# EAGLE design MiniGuruV2 (EAGLE 5.07)
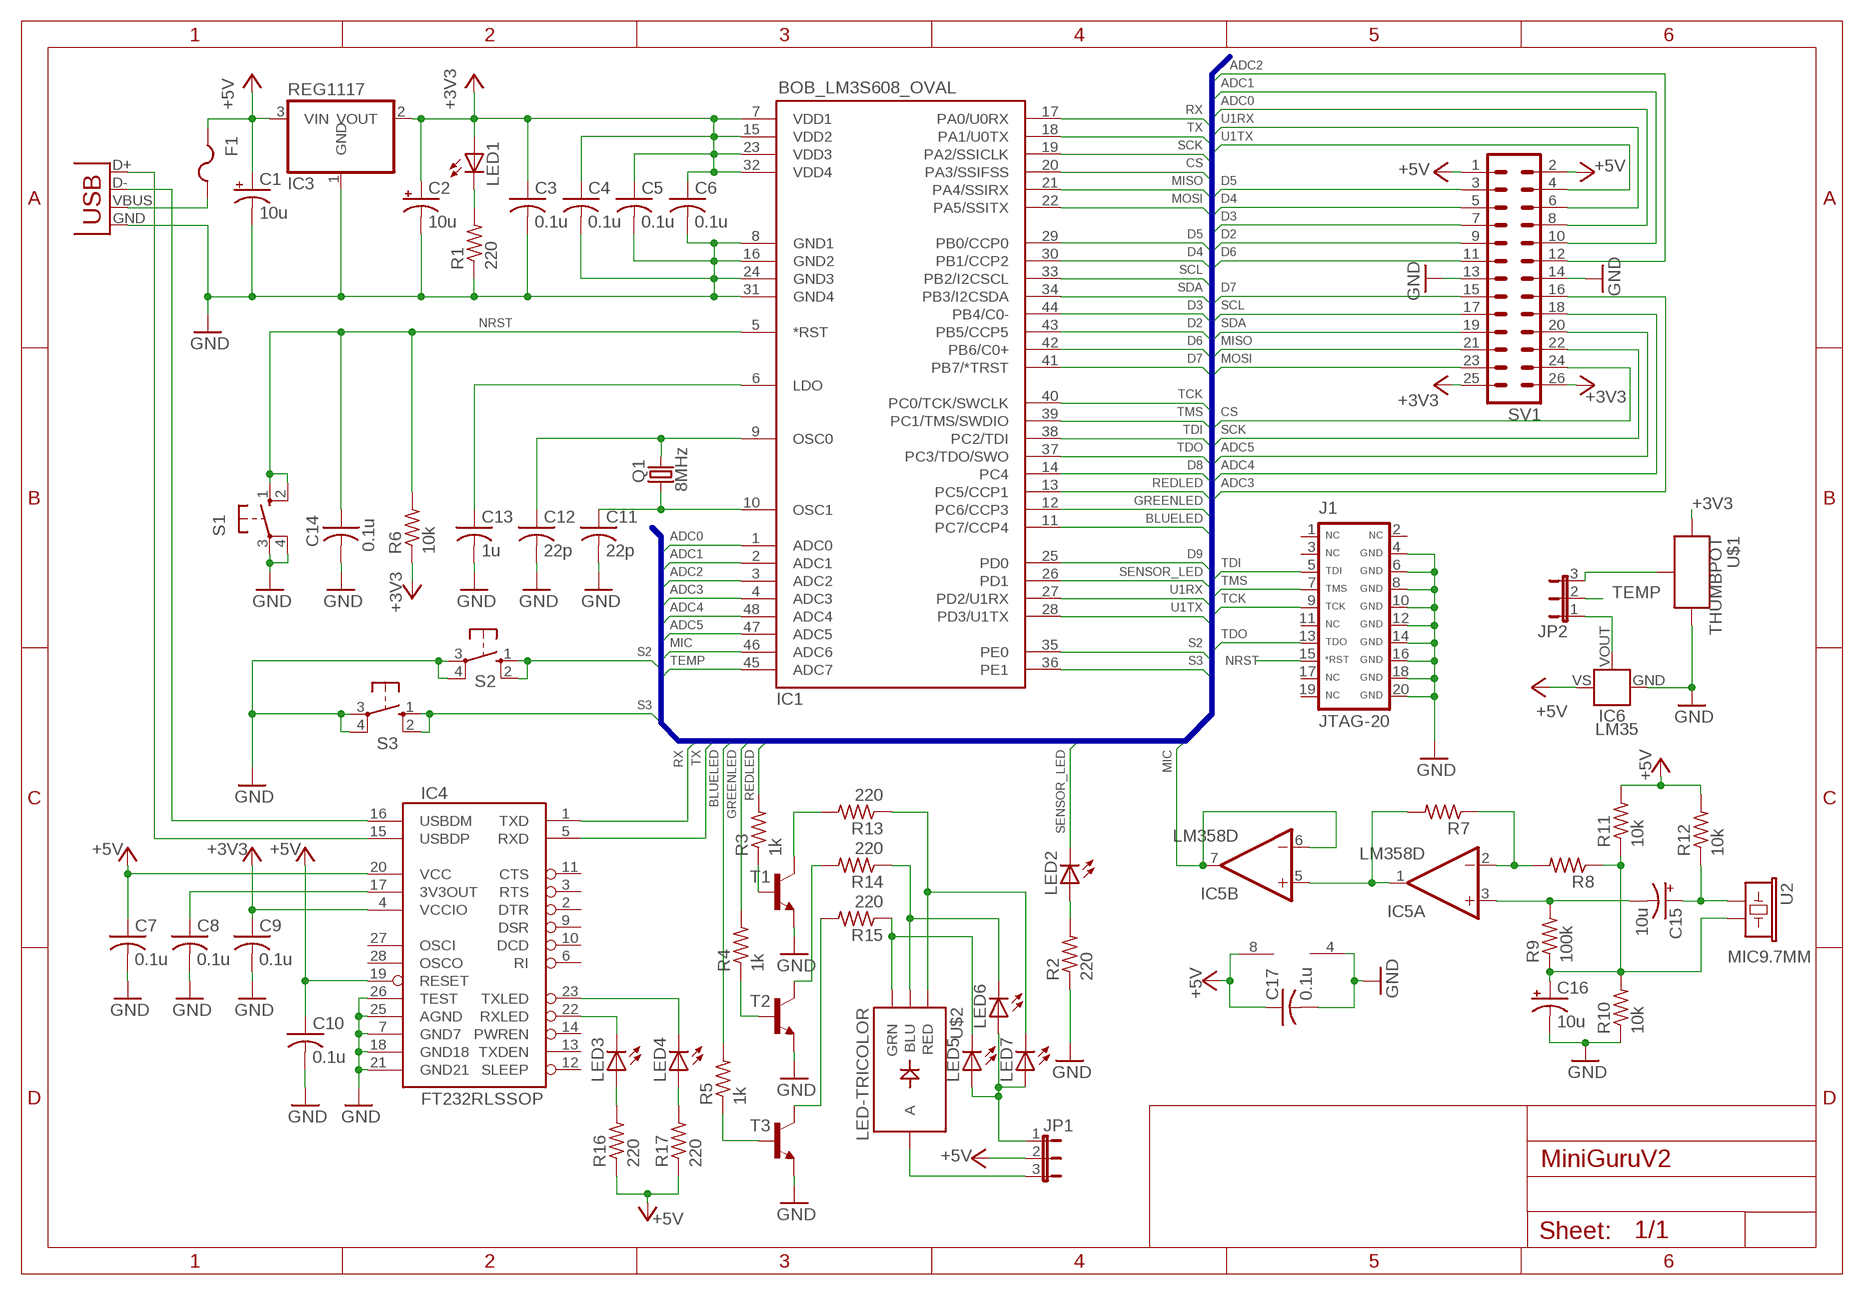
[diagram p0: schematic, sheet 1]

## Parts
C1  10u  CAP_POL_16V  [B/3528-21R]
C2  10u  CAP_POL_16V  [B/3528-21R]
C3  0.1u  C-USC0805  [C0805]
C4  0.1u  C-USC0805  [C0805]
C5  0.1u  C-USC0805  [C0805]
C6  0.1u  C-USC0805  [C0805]
C7  0.1u  C-USC0805  [C0805]
C8  0.1u  C-USC0805  [C0805]
C9  0.1u  C-USC0805  [C0805]
C10  0.1u  C-USC0805  [C0805]
C11  22p  C-USC0805  [C0805]
C12  22p  C-USC0805  [C0805]
C13  1u  C-USC1206  [C1206]
C14  0.1u  C-USC0805  [C0805]
C15  10u  CAP_POL_16V  [B/3528-21R]
C16  10u  CAP_POL_16V  [B/3528-21R]
C17  0.1u  C-USC0805  [C0805]
F1  PTCFUSE-1206  [R1206]
IC1  BOB_LM3S608_OVAL  [BOB_LQFP48_OVAL]
IC3  REG1117  [SOT223]
IC4  FT232RLSSOP  [SSOP28DB]
IC5  LM358D  [SO08]
IC6  LM35  LM35TO-92  [TO92]
J1  JTAG-20  [JTAG-20]
JP1  JP2W  [JP2W]
JP2  JP2W  [JP2W]
LED1  LEDSMT1206  [1206]
LED2  LEDSMT1206  [1206]
LED3  LEDSMT1206  [1206]
LED4  LEDSMT1206  [1206]
LED5  LEDSMT1206  [1206]
LED6  LEDSMT1206  [1206]
LED7  LEDSMT1206  [1206]
Q1  8MHz  CRYSTALHC49US  [HC49US]
R1  220  R-US_R0805  [R0805]
R2  220  R-US_R0805  [R0805]
R3  1k  R-US_R0805  [R0805]
R4  1k  R-US_R0805  [R0805]
R5  1k  R-US_R0805  [R0805]
R6  10k  R-US_R0805  [R0805]
R7  R-US_R0805  [R0805]
R8  R-US_R0805  [R0805]
R9  100k  R-US_R0805  [R0805]
R10  10k  R-US_R0805  [R0805]
R11  10k  R-US_R0805  [R0805]
R12  10k  R-US_R0805  [R0805]
R13  220  R-US_R0805  [R0805]
R14  220  R-US_R0805  [R0805]
R15  220  R-US_R0805  [R0805]
R16  220  R-US_R0805  [R0805]
R17  220  R-US_R0805  [R0805]
S1  10-XX  [B3F-10XX]
S2  10-XX  [B3F-10XX]
S3  10-XX  [B3F-10XX]
SV1  MA13-2  [MA13-2]
T1  BC847  [SOT23]
T2  BC847  [SOT23]
T3  BC847  [SOT23]
U2  MIC9.7MM  [MIC-9.7MM]
U$1  THUMBPOT  [THUMBPOT]
U$2  LED-TRICOLOR  [LED-TRICOLOR-SMD]
X1  USBSMD  [USB-MINIB]

## Nets
+3V3 [+3V3]: C2.+ C3.1 C4.1 C5.1 C6.1 C9.1 IC1.7(VDD1) IC1.15(VDD2) IC1.23(VDD3) IC1.32(VDD4) IC3.2(VOUT) IC4.4(VCCIO) LED1.A R6.1 SV1.25 SV1.26 U$1.1(E)
+5V [power]: C1.+ C7.1 C10.1 C17.1 F1.1 IC3.3(VIN) IC4.19(RESET) IC4.20(VCC) IC5.8(P:V+) IC6.VS JP1.2 R11.2 R12.2 R16.1 R17.1 SV1.1 SV1.2
ADC0: IC1.1(ADC0) SV1.8
ADC1: IC1.2(ADC1) SV1.10
ADC2: IC1.3(ADC2) SV1.12
ADC3: IC1.4(ADC3) SV1.16
ADC4: IC1.48(ADC4) SV1.18
ADC5: IC1.47(ADC5) SV1.20
BLUELED: IC1.11(PC7/CCP4) R5.2
CS: IC1.20(PA3/SSIFSS) SV1.24
D2: IC1.43(PB5/CCP5) SV1.9
D3: IC1.44(PB4/C0-) SV1.7
D4: IC1.30(PB1/CCP2) SV1.5
D5: IC1.29(PB0/CCP0) SV1.3
D6: IC1.42(PB6/C0+) SV1.11
D7: IC1.41(PB7/*TRST) SV1.15
D8: IC1.14(PC4)
D9: IC1.25(PD0)
GND [GND]: C1.- C2.- C3.2 C4.2 C5.2 C6.2 C7.2 C8.2 C9.2 C10.2 C11.2 C12.2 C13.2 C14.2 C16.- C17.2 IC1.8(GND1) IC1.16(GND2) IC1.24(GND3) IC1.31(GND4) IC3.1(GND) IC4.7(GND7) IC4.18(GND18) IC4.21(GND21) IC4.25(AGND) IC4.26(TEST) IC5.4(P:V-) IC6.GND J1.4(GND) J1.6(GND) J1.8(GND) J1.10(GND) J1.12(GND) J1.14(GND) J1.16(GND) J1.18(GND) J1.20(GND) R1.1 R2.1 R10.1 S1.3(P) S1.4(P1) S2.3(P) S2.4(P1) S3.3(P) S3.4(P1) SV1.13 SV1.14 T1.2(E) T2.2(E) T3.2(E) U$1.3(A) X1.GND
GREENLED: IC1.12(PC6/CCP3) R4.2
MIC: IC1.46(ADC6) IC5.6(B:-IN) IC5.7(B:OUT)
MISO: IC1.21(PA4/SSIRX) SV1.21
MOSI: IC1.22(PA5/SSITX) SV1.23
N$1: IC4.22(RXLED) LED3.C
N$2: IC4.16(USBDM) X1.D-
N$3: LED1.C R1.2
N$4: IC4.15(USBDP) X1.D+
N$5: C8.1 IC4.17(3V3OUT)
N$6: IC4.23(TXLED) LED4.C
N$7: LED4.A R17.2
N$8: LED3.A R16.2
N$9: IC6.VOUT JP2.1
N$10: R3.1 T1.1(B)
N$11: C12.1 IC1.9(OSC0) Q1.2
N$12: C11.1 IC1.10(OSC1) Q1.1
N$13: C13.1 IC1.6(LDO)
N$14: R4.1 T2.1(B)
N$15: R5.1 T3.1(B)
N$16: LED2.A R2.2
N$17: R13.2 T1.3(C)
N$18: IC5.1(A:OUT) IC5.5(B:+IN) R7.2
N$19: IC5.2(A:-IN) R7.1 R8.2
N$20: C15.+ R12.1 U2.1
N$21: C16.+ R8.1 R9.1 R10.2 R11.1 U2.2
N$22: C15.- IC5.3(A:+IN) R9.2
N$23: LED7.C R13.1 U$2.R(RED)
N$24: R14.2 T2.3(C)
N$25: LED6.C R14.1 U$2.B(BLU)
N$26: R15.2 T3.3(C)
N$27: LED5.C R15.1 U$2.G(GRN)
N$28 [power]: F1.2 X1.VBUS
N$29: JP2.3 U$1.2(S)
N$34: JP1.3 U$2.A
N$35 [power]: JP1.1 LED5.A LED6.A LED7.A
NRST: C14.1 IC1.5(*RST) J1.15(RST) R6.2 S1.1(S) S1.2(S1)
REDLED: IC1.13(PC5/CCP1) R3.2
RX: IC1.17(PA0/U0RX) IC4.1(TXD)
S2: IC1.35(PE0) S2.1(S) S2.2(S1)
S3: IC1.36(PE1) S3.1(S) S3.2(S1)
SCK: IC1.19(PA2/SSICLK) SV1.22
SCL: IC1.33(PB2/I2CSCL) SV1.17
SDA: IC1.34(PB3/I2CSDA) SV1.19
SENSOR_LED: IC1.26(PD1) LED2.C
TCK: IC1.40(PC0/TCK/SWCLK) J1.9(TCK)
TDI: IC1.38(PC2/TDI) J1.5(TDI)
TDO: IC1.37(PC3/TDO/SWO) J1.13(TDO)
TEMP: IC1.45(ADC7) JP2.2
TMS: IC1.39(PC1/TMS/SWDIO) J1.7(TMS)
TX: IC1.18(PA1/U0TX) IC4.5(RXD)
U1RX: IC1.27(PD2/U1RX) SV1.6
U1TX: IC1.28(PD3/U1TX) SV1.4
Unconnected: IC4.2(DTR) IC4.3(RTS) IC4.6(RI) IC4.9(DSR) IC4.10(DCD) IC4.11(CTS) IC4.12(SLEEP) IC4.13(TXDEN) IC4.14(PWREN) IC4.27(OSCI) IC4.28(OSCO) J1.1(VREF) J1.2(VTAR) J1.3(NTRST) J1.11(RTCK) J1.17(OBGRQ) J1.19(OBGACK)

## Buses
ADC0,ADC1,ADC2,ADC3,ADC4,ADC5,MISO,MOSI,CS,SCK,RX,TX,D2,D3,D4,D5,D6,D7,D8,D9,U1RX,U1TX,TCK,TMS,TDI,TDO,SENSOR_LED,REDLED,GREENLED,BLUELED,S2,S3,MIC,TEMP,SDA,SCL

## Library data of the parts
C1 C2 C15 C16 = CEDTv50:CAP_POL
C3-C14 C17 = adafruit:C-US: CAPACITOR, American symbol
F1 = adafruit:PTCFUSE: PTC fuses, resettable thermistors
IC1 = CEDTv51:BOB_LM3S608_OVAL
IC3 = CEDTv50:REG1117: 800mA and 1A Low Dropout (LDO) Positive Regulator 1.8V, 2.5V, 2.85V, 3.3V, 5V, and Adj
IC4 = SparkFun:FT232RL: USB UART FT232RL 4th Generation USB UART (USB <-> Serial) Controller. Spark Fun Electronics SKU : COM-00650
IC5 = linear:LM358: OP AMP also LM158; LM258; LM2904 Source: http://cache.national.com/ds/LM/LM158.pdf
IC6 = CEDTv50:LM35TO-92
J1 = CEDTv50:JTAG-20: JTAG 20-Pin Programming/Debug Connector
JP1 JP2 = jumper:JP2W: JUMPER
LED1-LED7 = adafruit:LED: LED OSRAM: - CHIPLED LG R971, LG N971, LY N971, LG Q971, LY Q971, LO R971, LY R971 LH N974, LH R974 LS Q976, LO Q976, LY Q976 LO Q996 - Hyper CHIPLED LW Q18S LB Q993, LB Q99A, LB R99A - SideLED LS A670, LO A670, LY A670, LG A670, LP A670 LB A673, LV A673, LT A673, LW A673 LH A674 LY A675 LS A676, LA A676, LO A676, LY A676, LW A676 LS A679, LY A679, LG A679 - Hyper Micro SIDELED® LS Y876, LA Y876, LO Y876, LY Y876 LT Y87S - SmartLED LW L88C, LW L88S LB L89C, LB L89S, LG L890 LS L89K, LO L89K, LY L89K LS L896, LA L896, LO L896, LY L896 - TOPLED LS T670, LO T670, LY T670, LG T670, LP T670 LSG T670, LSP T670, LSY T670, LOP T670, LYG T670 LG T671, LOG T671, LSG T671 LB T673, LV T673, LT T673, LW T673 LH T674 LS T676, LA T676, LO T676, LY T676, LB T676, LH T676, LSB T676, LW T676 LB T67C, LV T67C, LT T67C, LS T67K, LO T67K, LY T67K, LW E67C LS E67B, LA E67B, LO E67B, LY E67B, LB E67C, LV E67C, LT E67C LW T67C LS T679, LY T679, LG T679 LS T770, LO T770, LY T770, LG T770, LP T770 LB T773, LV T773, LT T773, LW T773 LH T774 LS E675, LA E675, LY E675, LS T675 LS T776, LA T776, LO T776, LY T776, LB T776 LHGB T686 LT T68C, LB T68C - Hyper Mini TOPLED® LB M676 - Mini TOPLED Santana® LG M470 LS M47K, LO M47K, LY M47K Source: http://www.osram.convergy.de/
Q1 = SparkFun:CRYSTAL: Crystals Various standard crystals. Proven footprints. Spark Fun Electronics SKU : COM-00534
R1 = resistor:R-US_: RESISTOR, American symbol
R2-R17 = adafruit:R-US_: RESISTOR, American symbol
S1-S3 = CEDTv50:10-XX: OMRON SWITCH
SV1 = con-lstb:MA13-2: PIN HEADER
T1-T3 = transistor:BC847: NPN TRANSISTOR
U2 = SparkFun:MIC: Microphone Omni-directional electret microphone. 9.7mm standard diameter.
U$1 = CEDTv51:THUMBPOT
U$2 = SparkFun:LED-TRICOLOR: Tri-Color LED SMD Proven layout and schematic for triple color LED in SMD package - common anode. Spark Fun Electronics SKU : COM-07844
X1 = SparkFun:USB: USB Connectors USB-B-PTH is fully proven SKU : PRT-00139 USB-miniB is fully proven SKU : PRT-00587 USB-A-PCB is untested. USB-A-H is throughly reviewed, but untested. Spark Fun Electronics SKU : PRT-00437 USB-B-SMT is throughly reviewed, but untested. Needs silkscreen touching up. USB-A-S has not been used/tested USB-MB-H has not been used/tested

## Net classes
0 default: width 0.406 mm
1 power: width 0.61 mm
2 +3V3: width 0.61 mm
3 GND: width 0.61 mm

## Board
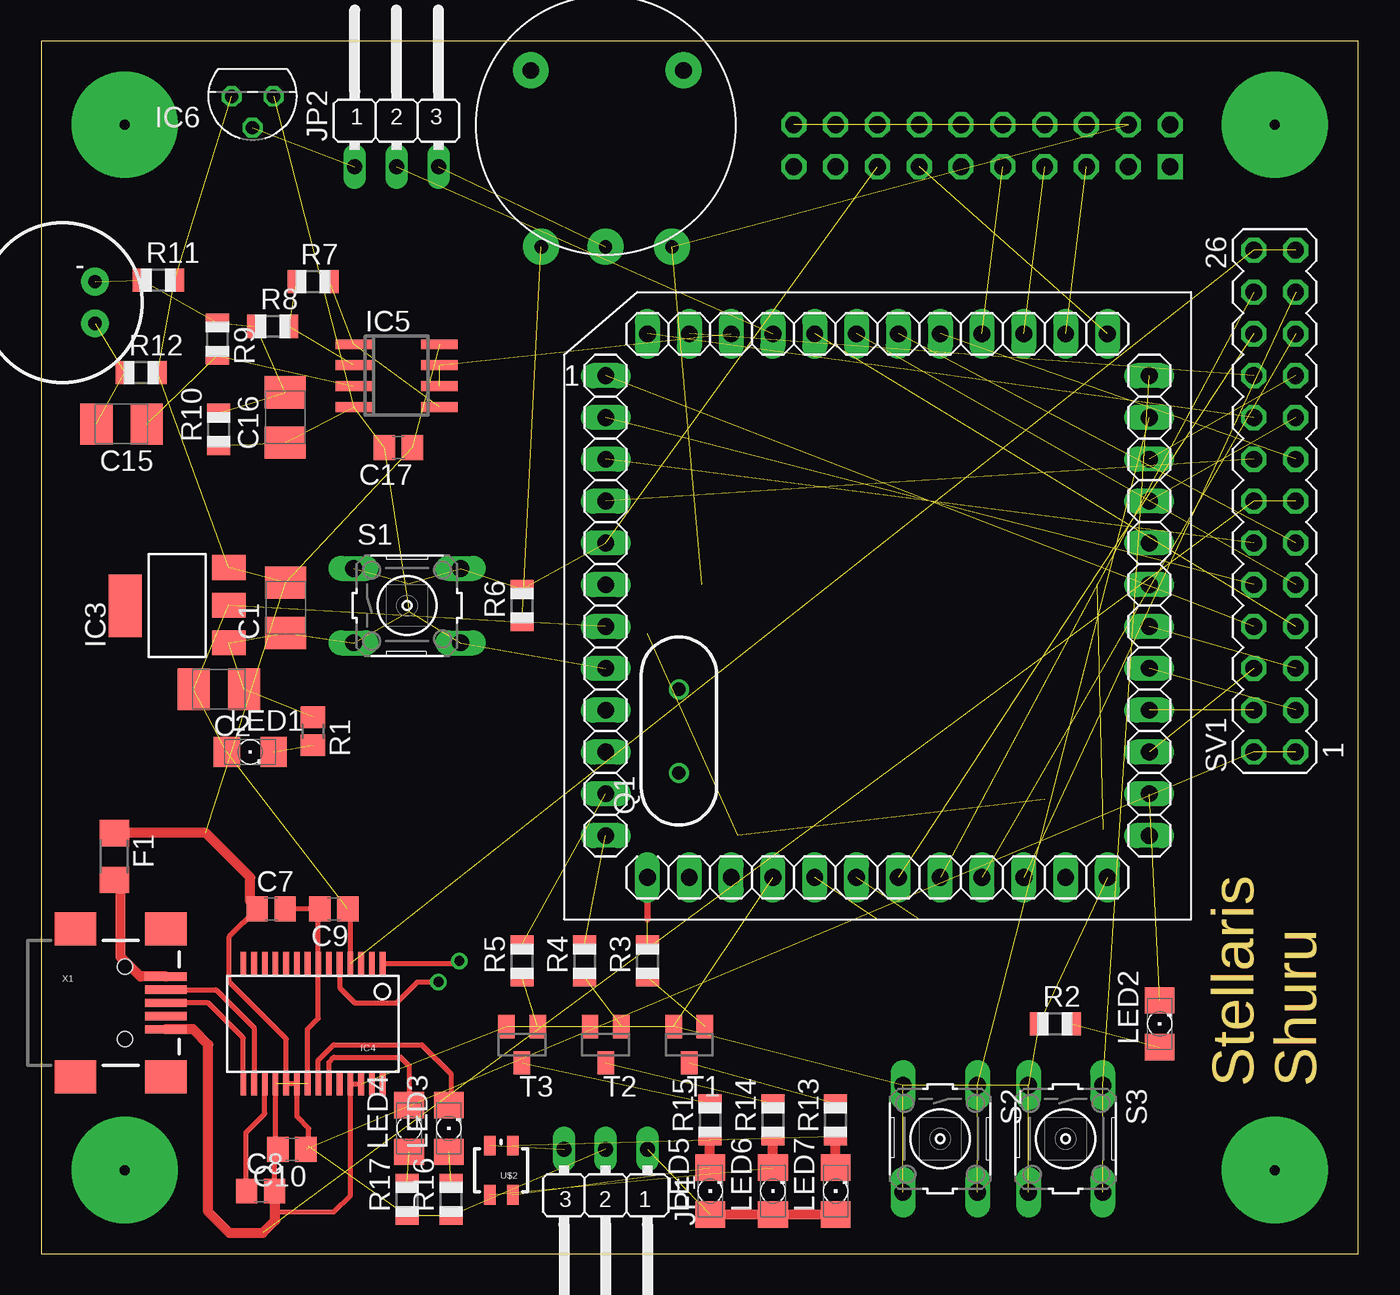
[diagram p1: board, top side]
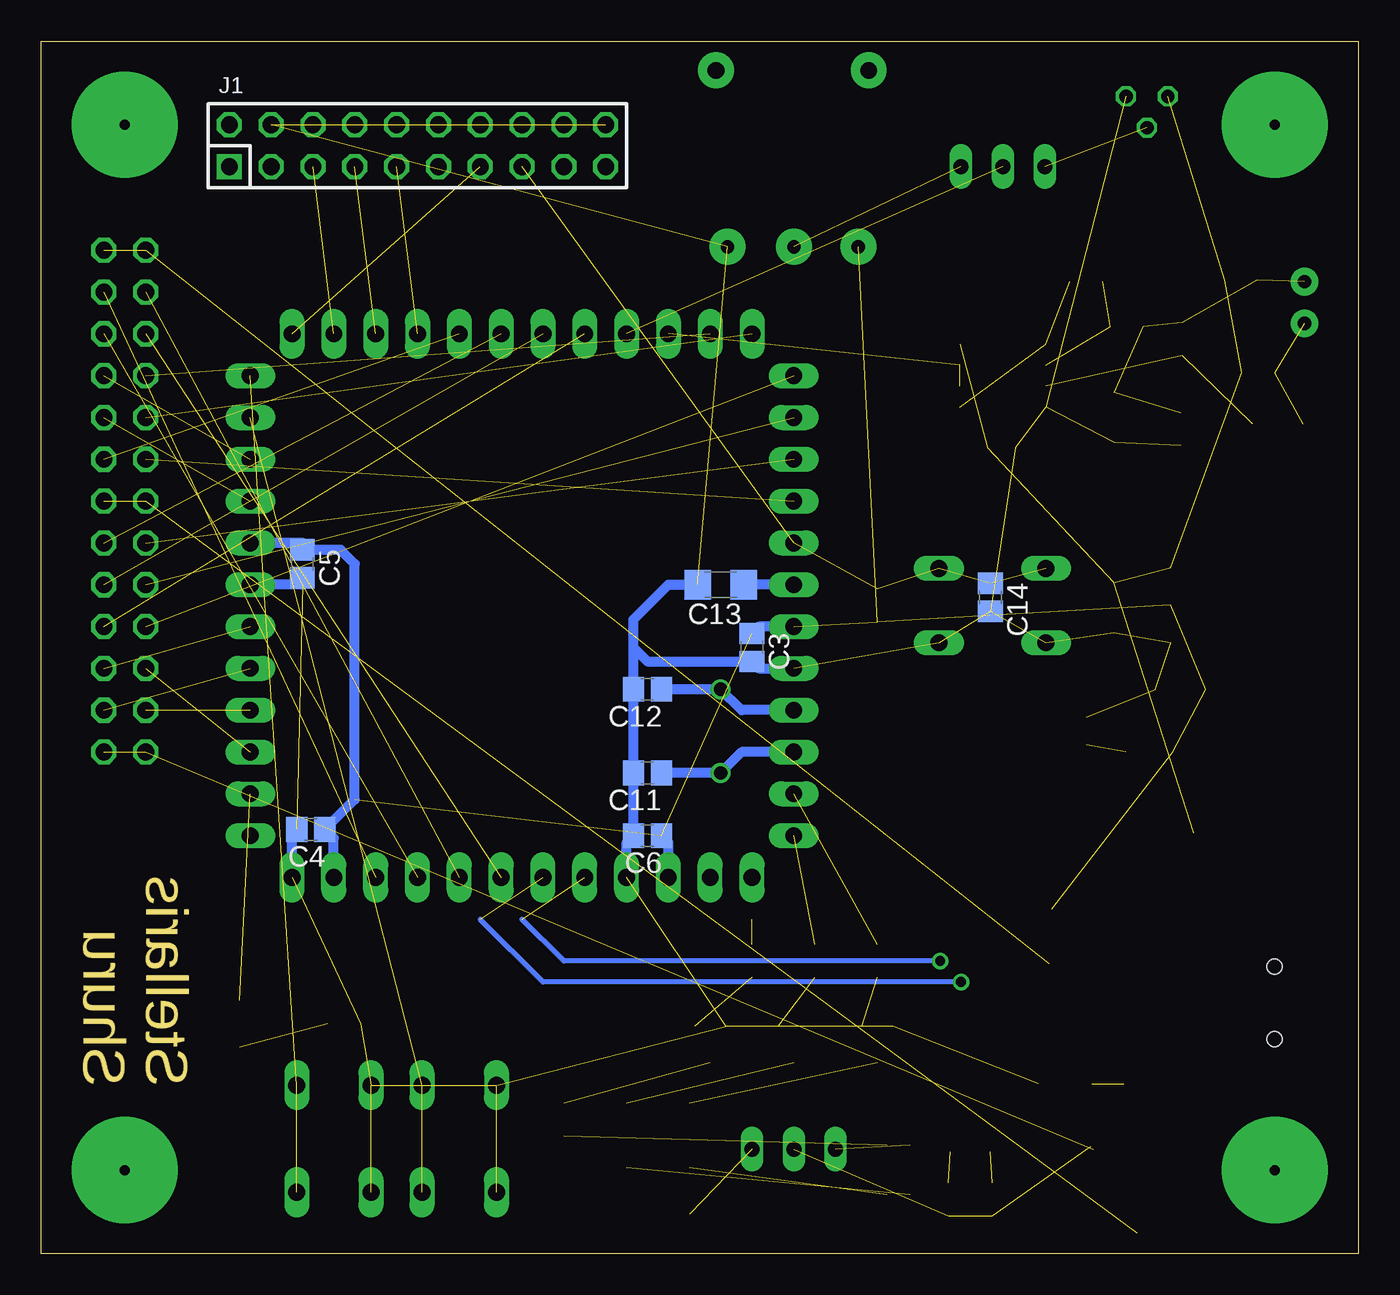
[diagram p2: board, bottom side, seen from below]

Size 80.01 x 73.66 mm. Coordinates in mm from the lower left corner, seen from the top.
Outline: 0,0 80.01,0 80.01,73.66 0,73.66 0,0
Copper layers (1*16): Top 0.035mm / dielectric 1.5mm / Bottom 0.035mm
Design rules "default *": minimum track width 10mil, minimum drill 0.6mm, track to track 8mil, track to pad 8mil, pad to pad 8mil, via to via 8mil, smd to smd 8mil, copper to edge 40mil, drill to drill 10mil, minimum pad ring 8mil, minimum via ring 8mil, stop-mask expansion 4mil, vias tented up to drill 0mil, thermal gap 10mil

### Footprints (pad centres in the part's own frame; a part is rotated, then mirrored left to right if it is on the bottom)
B/3528-21R = smd 1.95 x 2.5: + 1.525,0; - -1.525,0
C0805 = smd 1.3 x 1.5: 1 -0.85,0; 2 0.85,0
C1206 = smd 1.6 x 1.8: 1 -1.4,0; 2 1.4,0
R1206 = smd 1.6 x 1.803: 1 -1.422,0; 2 1.422,0
BOB_LQFP48_OVAL = drill 1.016 long: 1 -15.24,12.7; 2 -15.24,10.16; 3 -15.24,7.62; 4 -15.24,5.08; 5 -15.24,2.54; 6 -15.24,0; 7 -15.24,-2.54; 8 -15.24,-5.08; 9 -15.24,-7.62; 10 -15.24,-10.16; 11 -15.24,-12.7; 12 -15.24,-15.24; 13 -12.7,-17.78; 14 -10.16,-17.78; 15 -7.62,-17.78; 16 -5.08,-17.78; 17 -2.54,-17.78; 18 0,-17.78; 19 2.54,-17.78; 20 5.08,-17.78; 21 7.62,-17.78; 22 10.16,-17.78; 23 12.7,-17.78; 24 15.24,-17.78; 25 17.78,-15.24; 26 17.78,-12.7; 27 17.78,-10.16; 28 17.78,-7.62; 29 17.78,-5.08; 30 17.78,-2.54; 31 17.78,0; 32 17.78,2.54; 33 17.78,5.08; 34 17.78,7.62; 35 17.78,10.16; 36 17.78,12.7; 37 15.24,15.24; 38 12.7,15.24; 39 10.16,15.24; 40 7.62,15.24; 41 5.08,15.24; 42 2.54,15.24; 43 0,15.24; 44 -2.54,15.24; 45 -5.08,15.24; 46 -7.62,15.24; 47 -10.16,15.24; 48 -12.7,15.24
SOT223 = smd 1.499 x 2.007: 1 -2.261,-3.15; 2 0.025,-3.15; 3 2.311,-3.15 | smd 3.81 x 2.007: 4 0,3.15
SSOP28DB = smd 0.348 x 1.397: 1 -4.225,-3.656; 2 -3.575,-3.656; 3 -2.925,-3.656; 4 -2.275,-3.656; 5 -1.625,-3.656; 6 -0.975,-3.656; 7 -0.325,-3.656; 8 0.325,-3.656; 9 0.975,-3.656; 10 1.625,-3.656; 11 2.275,-3.656; 12 2.925,-3.656; 13 3.575,-3.656; 14 4.225,-3.656; 15 4.225,3.656; 16 3.575,3.656; 17 2.925,3.656; 18 2.275,3.656; 19 1.625,3.656; 20 0.975,3.656; 21 0.325,3.656; 22 -0.325,3.656; 23 -0.975,3.656; 24 -1.625,3.656; 25 -2.275,3.656; 26 -2.925,3.656; 27 -3.575,3.656; 28 -4.225,3.656
SO08 = smd 0.6 x 2.2: 1 -1.905,-2.6; 2 -0.635,-2.6; 3 0.635,-2.6; 4 1.905,-2.6; 5 1.905,2.6; 6 0.635,2.6; 7 -0.635,2.6; 8 -1.905,2.6
TO92 = drill 0.813 octagon: GND -1.27,0; VOUT 0,1.905; VS 1.27,0
JTAG-20 = drill 1.016 square: 1 -11.43,-1.27 | drill 1.016 octagon: 2 -11.43,1.27; 3 -8.89,-1.27; 4 -8.89,1.27; 5 -6.35,-1.27; 6 -6.35,1.27; 7 -3.81,-1.27; 8 -3.81,1.27; 9 -1.27,-1.27; 10 -1.27,1.27; 11 1.27,-1.27; 12 1.27,1.27; 13 3.81,-1.27; 14 3.81,1.27; 15 6.35,-1.27; 16 6.35,1.27; 17 8.89,-1.27; 18 8.89,1.27; 19 11.43,-1.27; 20 11.43,1.27
JP2W = drill 0.914 long: 1 -2.54,-1.27; 2 0,-1.27; 3 2.54,-1.27
1206 = smd 1.6 x 1.803: A -1.422,0; C 1.422,0
HC49US = drill 0.813 round: 1 -2.54,0; 2 2.54,0
R0805 = smd 1.3 x 1.5: 1 -0.85,0; 2 0.85,0
R0805' = smd 1.1 x 1.4: 1 -1,0; 2 1,0
B3F-10XX = drill 1.016 long: 1 -3.251,2.261; 2 3.251,2.261; 3 -3.251,-2.261; 4 3.251,-2.261
MA13-2 = drill 1.016 octagon: 1 -15.24,-1.27; 2 -15.24,1.27; 3 -12.7,-1.27; 4 -12.7,1.27; 5 -10.16,-1.27; 6 -10.16,1.27; 7 -7.62,-1.27; 8 -7.62,1.27; 9 -5.08,-1.27; 10 -5.08,1.27; 11 -2.54,-1.27; 12 -2.54,1.27; 13 0,-1.27; 14 0,1.27; 15 2.54,-1.27; 16 2.54,1.27; 17 5.08,-1.27; 18 5.08,1.27; 19 7.62,-1.27; 20 7.62,1.27; 21 10.16,-1.27; 22 10.16,1.27; 23 12.7,-1.27; 24 12.7,1.27; 25 15.24,-1.27; 26 15.24,1.27
SOT23 = smd 1 x 1.4: 1 -0.95,-1.1; 2 0.95,-1.1; 3 0,1.1
MIC-9.7MM = drill 0.8 pad 1.676 round: 1 -2,1.27; 2 -2,-1.27
THUMBPOT = drill 0.8 pad 2.184 round: 1 -3.912,-7.417; 2 0,-7.417; 3 4.039,-7.417 | drill 1.016 pad 2.184 round: P$4 4.724,3.302; P$5 -4.547,3.302
LED-TRICOLOR-SMD = smd 0.7 x 1.2: A 0.7,-1.5; B 0.7,1.5; G -0.7,1.5; R -0.7,-1.5
USB-MINIB = smd 2.5 x 0.5: D+ 2.5,0; D- 2.5,0.8; GND 2.5,-1.6; ID 2.5,-0.8; VBUS 2.5,1.6 | smd 2.5 x 2: GND@1 -3,-4.5; GND@2 -3,4.5; GND@3 2.5,4.5; GND@4 2.5,-4.5 | hole 0.9: 0,2.2; 0,-2.2

### Placement (x,y rotation side)
C1  14.86,39.24 90 top
C2  10.79,34.29 180 top
C3  36.83,36.83 270 bottom
C4  63.63,25.78 180 bottom
C5  64.14,41.91 270 bottom
C6  43.18,25.4 180 bottom
C7  13.97,20.95 0 top
C8  13.34,3.81 0 top
C9  17.78,20.95 180 top
C10  15.24,6.35 180 top
C11  43.18,29.21 180 bottom
C12  43.18,34.29 180 bottom
C13  38.73,40.64 180 bottom
C14  22.35,39.88 270 bottom
C15  4.88,50.4 180 top
C16  14.82,50.8 90 top
C17  21.69,48.97 180 top
F1  4.45,24.13 270 top
IC1  49.53,40.64 0 top
IC3  8.26,39.37 90 top
IC4  16.51,13.97 180 top
IC5  21.59,53.34 270 top
IC6  12.84,70.31 180 top
J1  57.15,67.31 0 bottom
JP1  34.29,5.08 180 top
JP2  21.59,67.31 0 top
LED1  12.7,30.48 0 top
LED2  67.94,13.97 90 top
LED3  24.77,7.62 90 top
LED4  22.35,7.62 90 top
LED5  40.64,3.81 90 top
LED6  44.45,3.81 90 top
LED7  48.26,3.81 90 top
Q1  38.73,31.75 90 top
R1  16.51,31.75 270 top
R2  220  [R0805']  61.59,13.97 0 top
R3  1k  [R0805']  36.83,17.78 90 top
R4  1k  [R0805']  33.02,17.78 90 top
R5  1k  [R0805']  29.21,17.78 90 top
R6  10k  [R0805']  29.21,39.37 90 top
R7  [R0805']  16.51,59.05 0 top
R8  [R0805']  14.07,56.33 0 top
R9  100k  [R0805']  10.71,55.56 270 top
R10  10k  [R0805']  10.79,50.08 90 top
R11  10k  [R0805']  7.12,59.15 0 top
R12  10k  [R0805']  6.08,53.53 0 top
R13  220  [R0805']  48.26,8.13 90 top
R14  220  [R0805']  44.45,8.13 90 top
R15  220  [R0805']  40.64,8.13 90 top
R16  220  [R0805']  24.89,3.3 90 top
R17  220  [R0805']  22.23,3.3 90 top
S1  22.23,39.37 0 top
S2  54.61,6.99 270 top
S3  62.23,6.99 270 top
SV1  74.93,45.72 90 top
T1  39.37,12.7 180 top
T2  34.29,12.7 180 top
T3  29.21,12.7 180 top
U2  1.27,57.78 180 top
U$1  34.29,68.58 0 top
U$2  27.94,5.08 180 top
X1  5.08,15.24 0 top

### Tracks (layer width: path | path; a pad name or v marks a point on that pad's centre or on a via)
+3V3  (10 unrouted)
  Top 0.305: IC4.4 18.79,20.8 C9.1
  Bottom 0.61: IC1.32 64.14,43.18 C5.1 61.81,42.76 60.96,41.91 60.96,27.6 C4.1 62.23,25.23 IC1.23 | IC1.15 41.91,24.98 C6.1 | IC1.7 36.41,38.1 C3.1
+5V  (12 unrouted)
  Top 0.305: C10.1 16.26,6.52 16.26,7.62 15.54,8.34 IC4.20 IC4.19 14.88,13.05 11.43,16.51 11.43,19.27 C7.1
  Top 0.61: F1.1 10.01,25.55 12.7,22.86 12.7,21.38 C7.1
ADC0  (1 unrouted)
ADC1  (1 unrouted)
ADC2  (1 unrouted)
ADC3  (1 unrouted)
ADC4  (1 unrouted)
ADC5  (1 unrouted)
BLUELED  (1 unrouted)
CS  (1 unrouted)
D2  (1 unrouted)
D3  (1 unrouted)
D4  (1 unrouted)
D5  (1 unrouted)
D6  (1 unrouted)
D7  (1 unrouted)
GND  (36 unrouted)
  Top 0.305: IC4.18 14.23,6.5 C10.2 14.19,6.14 C8.2 | C7.2 C9.2 16.84,20.86 IC4.7 16.84,14.29 16.18,13.64 IC4.21 | IC4.26 IC4.25 18.79,3.54 17.78,2.54 14.22,2.54
  Top 0.61: X1.GND 9.22,13.64 10.16,12.7 10.16,2.54 11.43,1.27 13.46,1.27 14.22,2.03 14.22,2.54 14.22,3.77 C8.2
  Bottom 0.61: IC1.31 64.14,40.64 C5.2 | IC1.24 64.77,25.4 64.48,25.4 C4.2 | IC1.16 44.45,24.98 C6.2 C11.2 C12.2 44.03,36.83 | IC1.8 36.41,35.56 C3.2 43.18,35.98 44.03,36.83 | C13.2 41.91,40.64 44.03,38.52 44.03,36.83
GREENLED  (1 unrouted)
MIC  (2 unrouted)
MISO  (1 unrouted)
MOSI  (1 unrouted)
N$1
  Top 0.305: IC4.22 16.84,11.76 17.78,12.7 23.11,12.7 24.89,10.92 24.89,9.17 LED3.C
N$2
  Top 0.305: X1.D- 10.63,16.04 12.94,13.73 IC4.16
N$3  (1 unrouted)
N$4
  Top 0.305: X1.D+ 10.16,15.24 12.29,13.12 IC4.15
N$5
  Top 0.305: IC4.17 13.59,8.51 12.45,7.37 12.45,3.85 C8.1
N$6
  Top 0.305: LED4.C 22.35,11.43 21.84,11.94 17.78,11.94 17.48,11.64 IC4.23
N$7  (1 unrouted)
N$8  (1 unrouted)
N$9  (1 unrouted)
N$10  (1 unrouted)
N$11
  Bottom 0.61: IC1.9 37.47,33.02 Q1.2 C12.1
N$12
  Bottom 0.61: IC1.10 37.47,30.48 Q1.1 C11.1
N$13
  Bottom 0.61: IC1.6 C13.1
N$14  (1 unrouted)
N$15  (1 unrouted)
N$16  (1 unrouted)
N$17  (1 unrouted)
N$18  (2 unrouted)
N$19  (2 unrouted)
N$20  (2 unrouted)
N$21  (5 unrouted)
N$22  (2 unrouted)
N$23  (1 unrouted)
  Top 0.61: LED7.C R13.1
N$24  (1 unrouted)
N$25  (1 unrouted)
  Top 0.61: LED6.C R14.1
N$26  (1 unrouted)
N$27  (1 unrouted)
  Top 0.61: LED5.C R15.1
N$28
  Top 0.61: X1.VBUS 6.02,16.84 4.83,18.03 4.83,22.33 F1.2
N$29  (1 unrouted)
N$30  (via drill 0.6 pad 6.45)
  other vias: 5.08,68.58
N$31  (via drill 0.6 pad 6.45)
  other vias: 74.93,68.58
N$32  (via drill 0.6 pad 6.45)
  other vias: 74.93,5.08
N$33  (via drill 0.6 pad 6.45)
  other vias: 5.08,5.08
N$34  (1 unrouted)
N$35  (1 unrouted)
  Top 0.61: LED7.A LED6.A LED5.A
NRST  (5 unrouted)
REDLED  (1 unrouted)
  Top 0.406: 36.83,20.32 IC1.13
RX  (via drill 0.6)  (1 unrouted)
  Top 0.305: IC4.1 25.25,17.63 v25.4,17.78
  Bottom 0.305: v25.4,17.78 48.26,17.78 50.8,20.32
S2  (2 unrouted)
S3  (2 unrouted)
SCK  (1 unrouted)
SCL  (1 unrouted)
SDA  (1 unrouted)
SENSOR_LED  (1 unrouted)
TCK  (1 unrouted)
TDI  (1 unrouted)
TDO  (1 unrouted)
TEMP  (1 unrouted)
TMS  (1 unrouted)
TX  (via drill 0.6)  (1 unrouted)
  Top 0.305: IC4.5 18.14,16.16 19.05,15.24 21.59,15.24 22.86,16.51 v24.13,16.51
  Bottom 0.305: v24.13,16.51 49.53,16.51 53.34,20.32
U1RX  (1 unrouted)
U1TX  (1 unrouted)

### Text on the board
Dimension: Stellaris | Shuru